# EAGLE schematic filterboard (EAGLE 6.5.0)
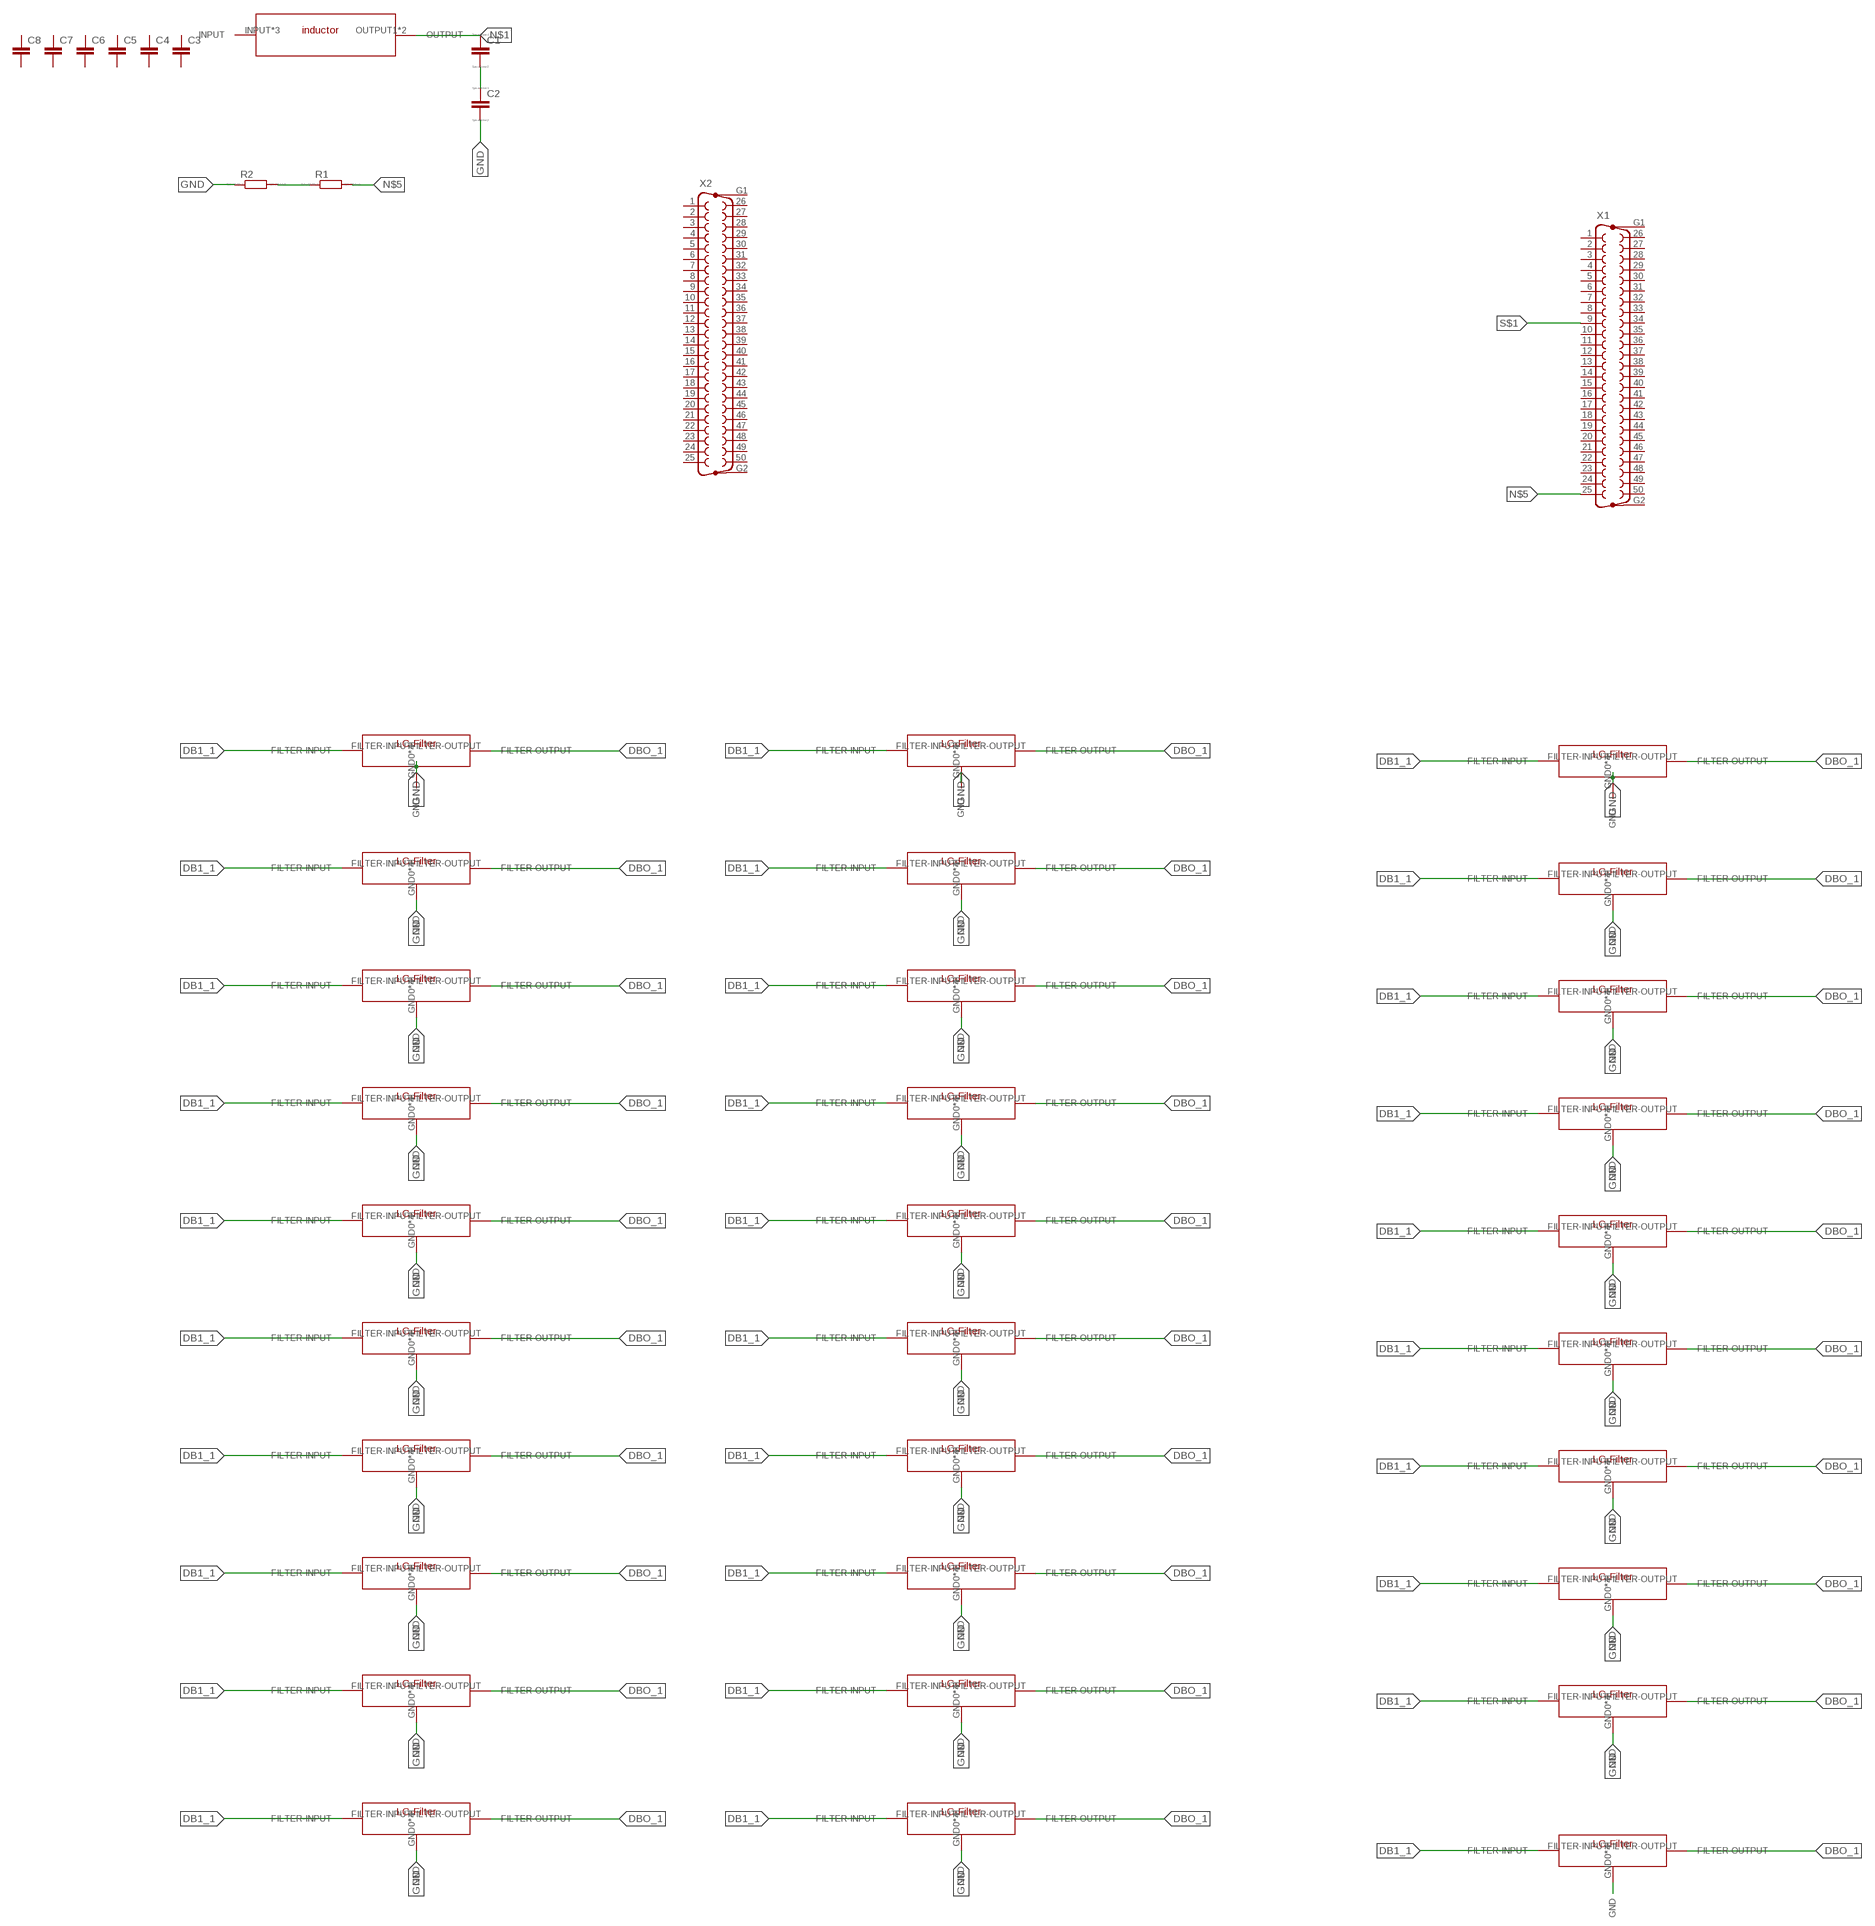
[diagram p0: schematic, sheet 1, part 1 of 2]
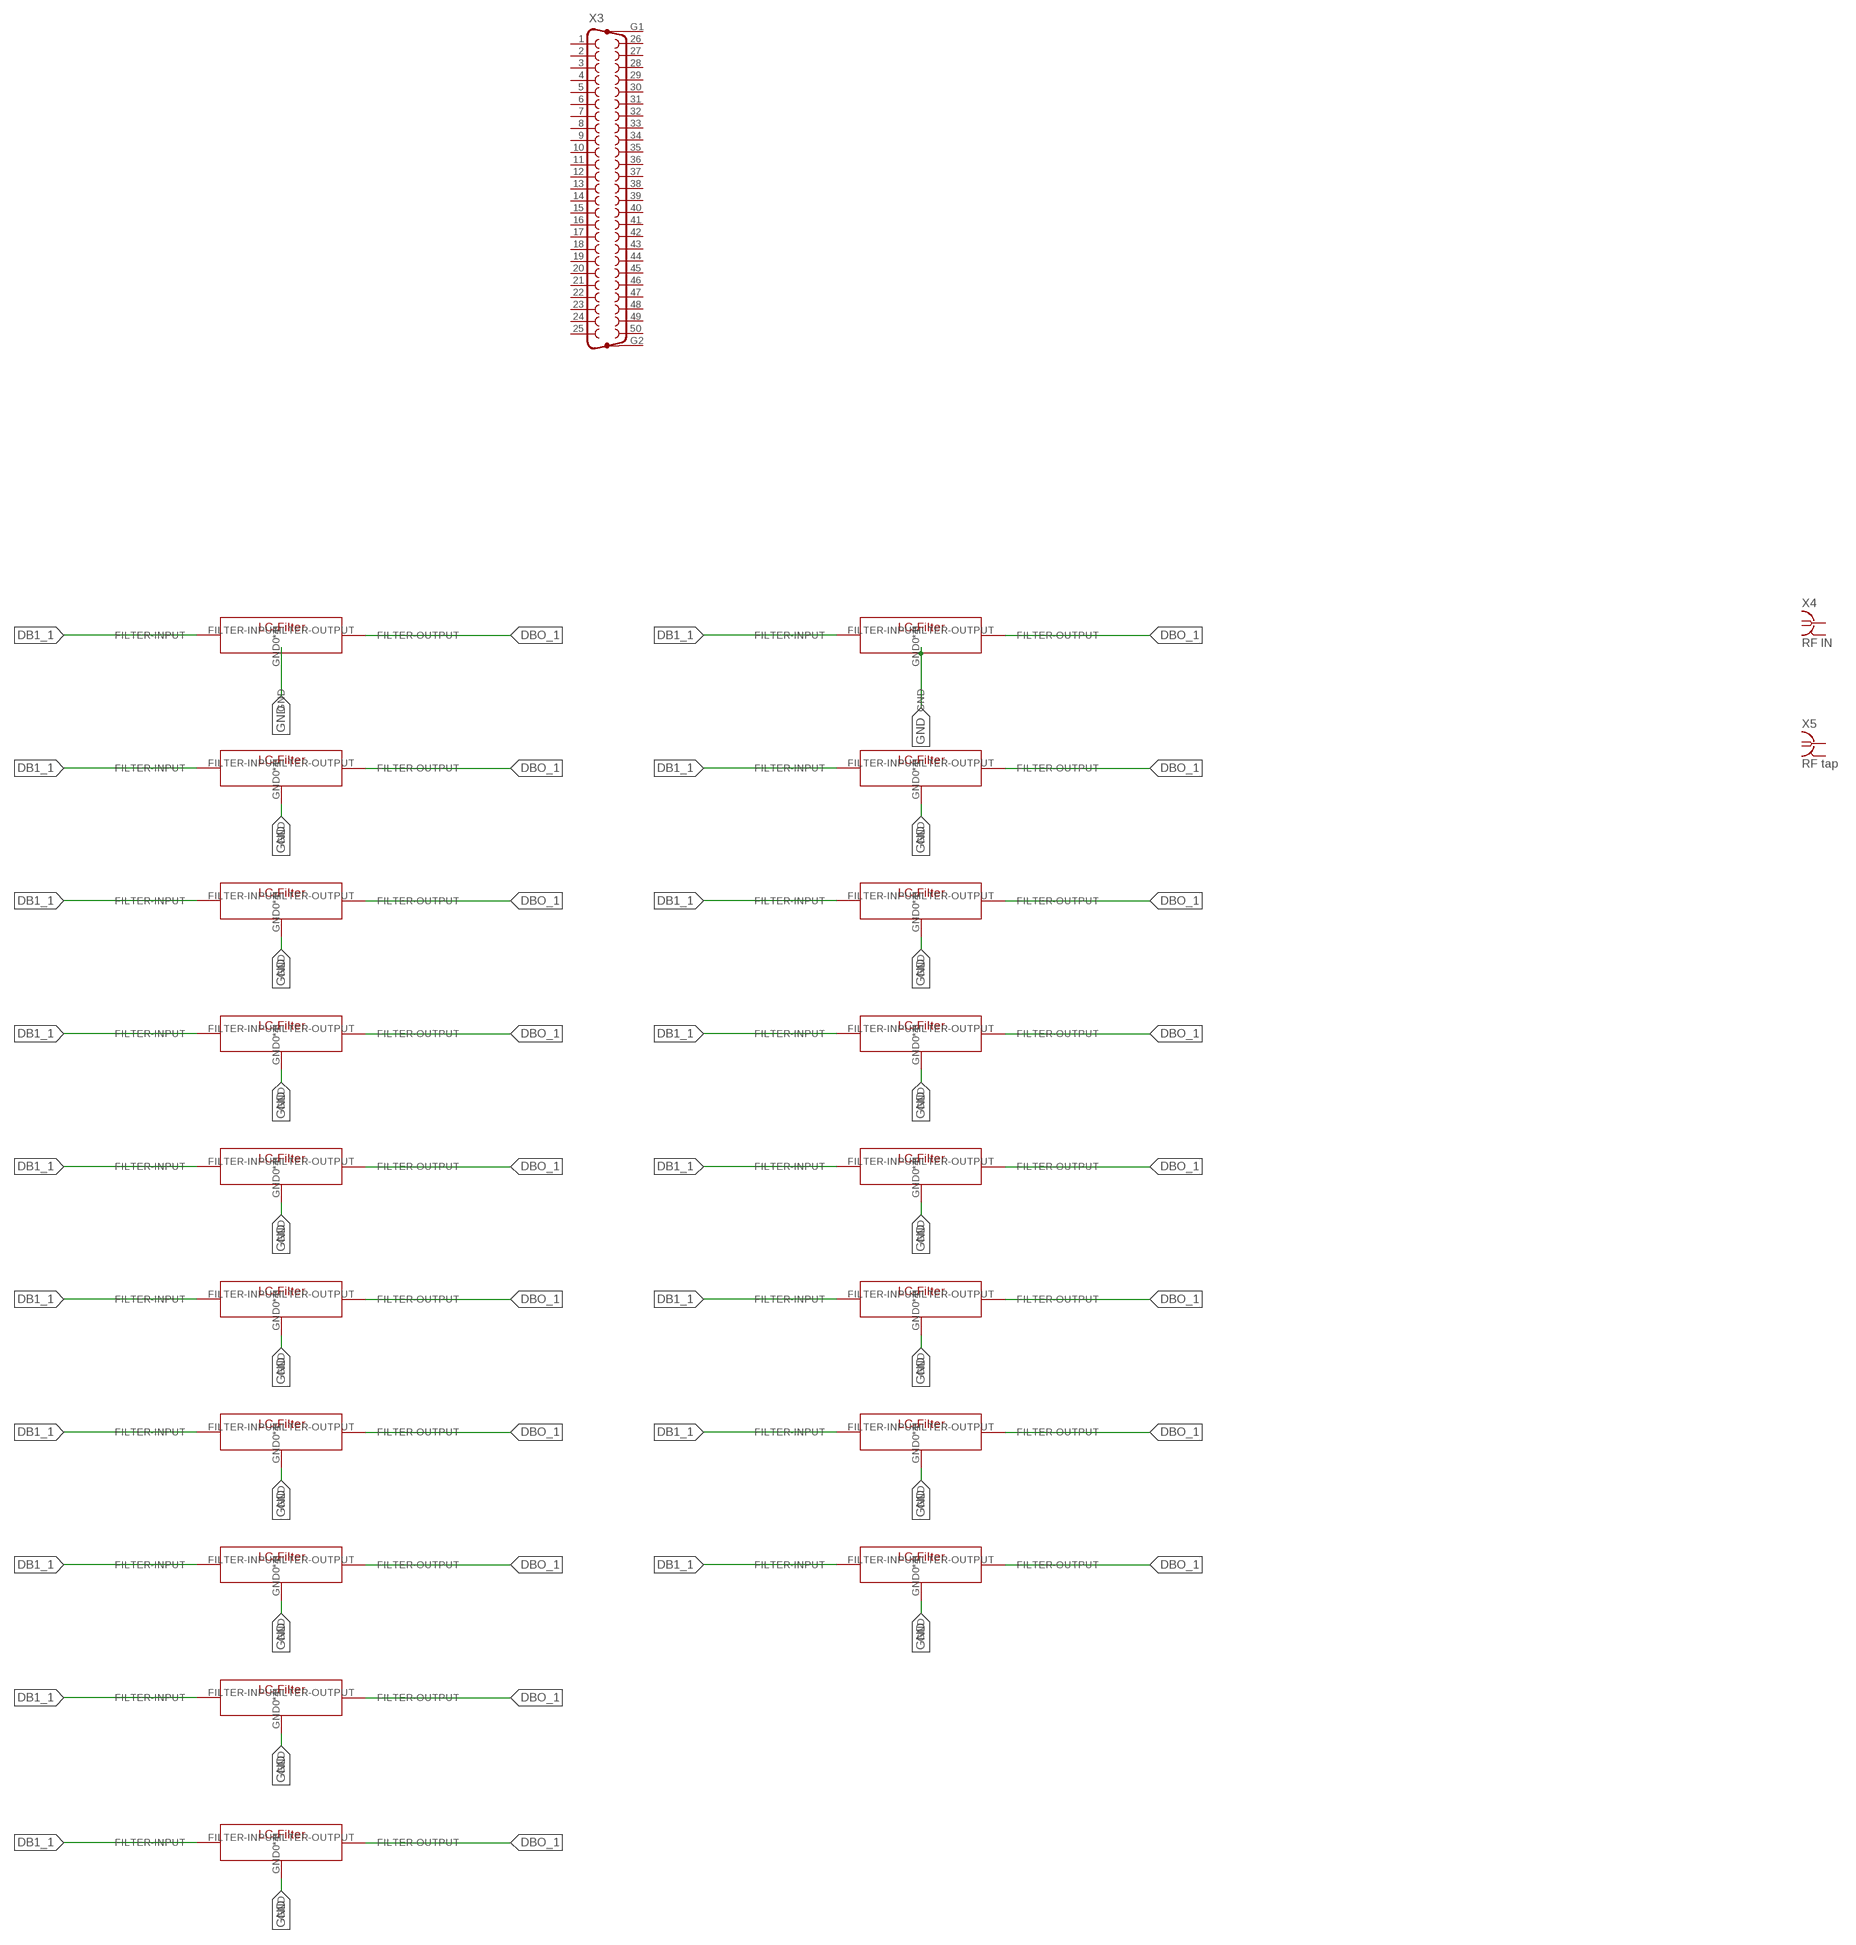
[diagram p1: schematic, sheet 1, part 2 of 2]

## Parts
C1  C  [C0805]
C2  C  [C0805]
C3  C5/4.5  [C5B4.5]
C4  C5/4.5  [C5B4.5]
C5  C5/4.5  [C5B4.5]
C6  C5/4.5  [C5B4.5]
C7  C5/4.5  [C5B4.5]
C8  C5/4.5  [C5B4.5]
R1  RR0603  [R0603]
R2  RR0603  [R0603]
U$1  COILCRAFT-LC7POLE  [COILCRAFT-LC7POLE]
U$2  COILCRAFT-LC7POLE  [COILCRAFT-LC7POLE]
U$3  COILCRAFT-LC7POLE  [COILCRAFT-LC7POLE]
U$4  COILCRAFT-LC7POLE  [COILCRAFT-LC7POLE]
U$5  COILCRAFT-LC7POLE  [COILCRAFT-LC7POLE]
U$6  COILCRAFT-LC7POLE  [COILCRAFT-LC7POLE]
U$7  COILCRAFT-LC7POLE  [COILCRAFT-LC7POLE]
U$8  COILCRAFT-LC7POLE  [COILCRAFT-LC7POLE]
U$9  COILCRAFT-LC7POLE  [COILCRAFT-LC7POLE]
U$10  COILCRAFT-LC7POLE  [COILCRAFT-LC7POLE]
U$11  COILCRAFT-LC7POLE  [COILCRAFT-LC7POLE]
U$12  COILCRAFT-LC7POLE  [COILCRAFT-LC7POLE]
U$13  COILCRAFT-LC7POLE  [COILCRAFT-LC7POLE]
U$14  COILCRAFT-LC7POLE  [COILCRAFT-LC7POLE]
U$15  COILCRAFT-LC7POLE  [COILCRAFT-LC7POLE]
U$16  COILCRAFT-LC7POLE  [COILCRAFT-LC7POLE]
U$17  COILCRAFT-LC7POLE  [COILCRAFT-LC7POLE]
U$18  COILCRAFT-LC7POLE  [COILCRAFT-LC7POLE]
U$19  COILCRAFT-LC7POLE  [COILCRAFT-LC7POLE]
U$20  COILCRAFT-LC7POLE  [COILCRAFT-LC7POLE]
U$21  COILCRAFT-LC7POLE  [COILCRAFT-LC7POLE]
U$22  COILCRAFT-LC7POLE  [COILCRAFT-LC7POLE]
U$23  COILCRAFT-LC7POLE  [COILCRAFT-LC7POLE]
U$24  COILCRAFT-LC7POLE  [COILCRAFT-LC7POLE]
U$25  COILCRAFT-LC7POLE  [COILCRAFT-LC7POLE]
U$26  COILCRAFT-LC7POLE  [COILCRAFT-LC7POLE]
U$27  COILCRAFT-LC7POLE  [COILCRAFT-LC7POLE]
U$28  COILCRAFT-LC7POLE  [COILCRAFT-LC7POLE]
U$29  COILCRAFT-LC7POLE  [COILCRAFT-LC7POLE]
U$30  COILCRAFT-LC7POLE  [COILCRAFT-LC7POLE]
U$31  COILCRAFT-LC7POLE  [COILCRAFT-LC7POLE]
U$32  COILCRAFT-LC7POLE  [COILCRAFT-LC7POLE]
U$33  COILCRAFT-LC7POLE  [COILCRAFT-LC7POLE]
U$34  COILCRAFT-LC7POLE  [COILCRAFT-LC7POLE]
U$35  COILCRAFT-LC7POLE  [COILCRAFT-LC7POLE]
U$36  COILCRAFT-LC7POLE  [COILCRAFT-LC7POLE]
U$37  COILCRAFT-LC7POLE  [COILCRAFT-LC7POLE]
U$38  COILCRAFT-LC7POLE  [COILCRAFT-LC7POLE]
U$39  COILCRAFT-LC7POLE  [COILCRAFT-LC7POLE]
U$40  COILCRAFT-LC7POLE  [COILCRAFT-LC7POLE]
U$41  COILCRAFT-LC7POLE  [COILCRAFT-LC7POLE]
U$42  COILCRAFT-LC7POLE  [COILCRAFT-LC7POLE]
U$43  COILCRAFT-LC7POLE  [COILCRAFT-LC7POLE]
U$44  COILCRAFT-LC7POLE  [COILCRAFT-LC7POLE]
U$45  COILCRAFT-LC7POLE  [COILCRAFT-LC7POLE]
U$46  COILCRAFT-LC7POLE  [COILCRAFT-LC7POLE]
U$47  COILCRAFT-LC7POLE  [COILCRAFT-LC7POLE]
U$48  COILCRAFT-LC7POLE  [COILCRAFT-LC7POLE]
U$49  XINDUCTOR  [XINDUCTOR]
X1  F50HP  [F50HP]
X2  F50HP  [F50HP]
X3  F50HP  [F50HP]
X4  RF IN  SMA-142-0711-821/826  [J502-ND-142-0711-821/826]
X5  RF tap  SMA-142-0711-821/826  [J502-ND-142-0711-821/826]

## Nets
GND: C2.2 R2.1 U$9.GND0(GND) U$9.GND1(GND) U$9.GND2(GND) U$9.GND3(GND) U$36.GND0(GND) U$36.GND1(GND) U$36.GND2(GND) U$36.GND3(GND) U$45.GND0(GND) U$45.GND1(GND) U$45.GND2(GND) U$45.GND3(GND)
N$1: C1.1
N$2: C1.2 C2.1
N$3: R1.1 R2.2
N$5: R1.2 X1.25
S$1: X1.9
Unconnected: C3.1 C3.2 C4.1 C4.2 C5.1 C5.2 C6.1 C6.2 C7.1 C7.2 C8.1 C8.2 U$1.FILTER-INPUT U$1.FILTER-OUTPUT U$1.GND0(GND) U$1.GND1(GND) U$1.GND2(GND) U$1.GND3(GND) U$2.FILTER-INPUT U$2.FILTER-OUTPUT U$2.GND0(GND) U$2.GND1(GND) U$2.GND2(GND) U$2.GND3(GND) U$3.FILTER-INPUT U$3.FILTER-OUTPUT U$3.GND0(GND) U$3.GND1(GND) U$3.GND2(GND) U$3.GND3(GND) U$4.FILTER-INPUT U$4.FILTER-OUTPUT U$4.GND0(GND) U$4.GND1(GND) U$4.GND2(GND) U$4.GND3(GND) U$5.FILTER-INPUT U$5.FILTER-OUTPUT U$5.GND0(GND) U$5.GND1(GND) U$5.GND2(GND) U$5.GND3(GND) U$6.FILTER-INPUT U$6.FILTER-OUTPUT U$6.GND0(GND) U$6.GND1(GND) U$6.GND2(GND) U$6.GND3(GND) U$7.FILTER-INPUT U$7.FILTER-OUTPUT U$7.GND0(GND) U$7.GND1(GND) U$7.GND2(GND) U$7.GND3(GND) U$8.FILTER-INPUT U$8.FILTER-OUTPUT U$8.GND0(GND) U$8.GND1(GND) U$8.GND2(GND) U$8.GND3(GND) U$9.FILTER-INPUT U$9.FILTER-OUTPUT U$10.FILTER-INPUT U$10.FILTER-OUTPUT U$10.GND0(GND) U$10.GND1(GND) U$10.GND2(GND) U$10.GND3(GND) U$11.FILTER-INPUT U$11.FILTER-OUTPUT U$11.GND0(GND) U$11.GND1(GND) U$11.GND2(GND) U$11.GND3(GND) U$12.FILTER-INPUT U$12.FILTER-OUTPUT U$12.GND0(GND) U$12.GND1(GND) U$12.GND2(GND) U$12.GND3(GND) U$13.FILTER-INPUT U$13.FILTER-OUTPUT U$13.GND0(GND) U$13.GND1(GND) U$13.GND2(GND) U$13.GND3(GND) U$14.FILTER-INPUT U$14.FILTER-OUTPUT U$14.GND0(GND) U$14.GND1(GND) U$14.GND2(GND) U$14.GND3(GND) U$15.FILTER-INPUT U$15.FILTER-OUTPUT U$15.GND0(GND) U$15.GND1(GND) U$15.GND2(GND) U$15.GND3(GND) U$16.FILTER-INPUT U$16.FILTER-OUTPUT U$16.GND0(GND) U$16.GND1(GND) U$16.GND2(GND) U$16.GND3(GND) U$17.FILTER-INPUT U$17.FILTER-OUTPUT U$17.GND0(GND) U$17.GND1(GND) U$17.GND2(GND) U$17.GND3(GND) U$18.FILTER-INPUT U$18.FILTER-OUTPUT U$18.GND0(GND) U$18.GND1(GND) U$18.GND2(GND) U$18.GND3(GND) U$19.FILTER-INPUT U$19.FILTER-OUTPUT U$19.GND0(GND) U$19.GND1(GND) U$19.GND2(GND) U$19.GND3(GND) U$20.FILTER-INPUT U$20.FILTER-OUTPUT U$20.GND0(GND) U$20.GND1(GND) U$20.GND2(GND) U$20.GND3(GND) U$21.FILTER-INPUT U$21.FILTER-OUTPUT U$21.GND0(GND) U$21.GND1(GND) U$21.GND2(GND) U$21.GND3(GND) U$22.FILTER-INPUT U$22.FILTER-OUTPUT U$22.GND0(GND) U$22.GND1(GND) U$22.GND2(GND) U$22.GND3(GND) U$23.FILTER-INPUT U$23.FILTER-OUTPUT U$23.GND0(GND) U$23.GND1(GND) U$23.GND2(GND) U$23.GND3(GND) U$24.FILTER-INPUT U$24.FILTER-OUTPUT U$24.GND0(GND) U$24.GND1(GND) U$24.GND2(GND) U$24.GND3(GND) U$25.FILTER-INPUT U$25.FILTER-OUTPUT U$25.GND0(GND) U$25.GND1(GND) U$25.GND2(GND) U$25.GND3(GND) U$26.FILTER-INPUT U$26.FILTER-OUTPUT U$26.GND0(GND) U$26.GND1(GND) U$26.GND2(GND) U$26.GND3(GND) U$27.FILTER-INPUT U$27.FILTER-OUTPUT U$27.GND0(GND) U$27.GND1(GND) U$27.GND2(GND) U$27.GND3(GND) U$28.FILTER-INPUT U$28.FILTER-OUTPUT U$28.GND0(GND) U$28.GND1(GND) U$28.GND2(GND) U$28.GND3(GND) U$29.FILTER-INPUT U$29.FILTER-OUTPUT U$29.GND0(GND) U$29.GND1(GND) U$29.GND2(GND) U$29.GND3(GND) U$30.FILTER-INPUT U$30.FILTER-OUTPUT U$30.GND0(GND) U$30.GND1(GND) U$30.GND2(GND) U$30.GND3(GND) U$31.FILTER-INPUT U$31.FILTER-OUTPUT U$31.GND0(GND) U$31.GND1(GND) U$31.GND2(GND) U$31.GND3(GND) U$32.FILTER-INPUT U$32.FILTER-OUTPUT U$32.GND0(GND) U$32.GND1(GND) U$32.GND2(GND) U$32.GND3(GND) U$33.FILTER-INPUT U$33.FILTER-OUTPUT U$33.GND0(GND) U$33.GND1(GND) U$33.GND2(GND) U$33.GND3(GND) U$34.FILTER-INPUT U$34.FILTER-OUTPUT U$34.GND0(GND) U$34.GND1(GND) U$34.GND2(GND) U$34.GND3(GND) U$35.FILTER-INPUT U$35.FILTER-OUTPUT U$35.GND0(GND) U$35.GND1(GND) U$35.GND2(GND) U$35.GND3(GND) U$36.FILTER-INPUT U$36.FILTER-OUTPUT U$37.FILTER-INPUT U$37.FILTER-OUTPUT U$37.GND0(GND) U$37.GND1(GND) U$37.GND2(GND) U$37.GND3(GND) U$38.FILTER-INPUT U$38.FILTER-OUTPUT U$38.GND0(GND) U$38.GND1(GND) U$38.GND2(GND) U$38.GND3(GND) U$39.FILTER-INPUT U$39.FILTER-OUTPUT U$39.GND0(GND) U$39.GND1(GND) U$39.GND2(GND) U$39.GND3(GND) U$40.FILTER-INPUT U$40.FILTER-OUTPUT U$40.GND0(GND) U$40.GND1(GND) U$40.GND2(GND) U$40.GND3(GND) U$41.FILTER-INPUT U$41.FILTER-OUTPUT U$41.GND0(GND) U$41.GND1(GND) U$41.GND2(GND) U$41.GND3(GND) U$42.FILTER-INPUT U$42.FILTER-OUTPUT U$42.GND0(GND) U$42.GND1(GND) U$42.GND2(GND) U$42.GND3(GND) U$43.FILTER-INPUT U$43.FILTER-OUTPUT U$43.GND0(GND) U$43.GND1(GND) U$43.GND2(GND) U$43.GND3(GND) U$44.FILTER-INPUT U$44.FILTER-OUTPUT U$44.GND0(GND) U$44.GND1(GND) U$44.GND2(GND) U$44.GND3(GND) U$45.FILTER-INPUT U$45.FILTER-OUTPUT U$46.FILTER-INPUT U$46.FILTER-OUTPUT U$46.GND0(GND) U$46.GND1(GND) U$46.GND2(GND) U$46.GND3(GND) U$47.FILTER-INPUT U$47.FILTER-OUTPUT U$47.GND0(GND) U$47.GND1(GND) U$47.GND2(GND) U$47.GND3(GND) U$48.FILTER-INPUT U$48.FILTER-OUTPUT U$48.GND0(GND) U$48.GND1(GND) U$48.GND2(GND) U$48.GND3(GND) U$49.INPUT U$49.INPUT2(INPUT) U$49.INPUT3(INPUT) U$49.OUTPUT1(OUTPUT) U$49.OUTPUT2(OUTPUT) X1.1 X1.2 X1.3 X1.4 X1.5 X1.6 X1.7 X1.8 X1.10 X1.11 X1.12 X1.13 X1.14 X1.15 X1.16 X1.17 X1.18 X1.19 X1.20 X1.21 X1.22 X1.23 X1.24 X1.26 X1.27 X1.28 X1.29 X1.30 X1.31 X1.32 X1.33 X1.34 X1.35 X1.36 X1.37 X1.38 X1.39 X1.40 X1.41 X1.42 X1.43 X1.44 X1.45 X1.46 X1.47 X1.48 X1.49 X1.50 X1.G1 X1.G2 X2.1 X2.2 X2.3 X2.4 X2.5 X2.6 X2.7 X2.8 X2.9 X2.10 X2.11 X2.12 X2.13 X2.14 X2.15 X2.16 X2.17 X2.18 X2.19 X2.20 X2.21 X2.22 X2.23 X2.24 X2.25 X2.26 X2.27 X2.28 X2.29 X2.30 X2.31 X2.32 X2.33 X2.34 X2.35 X2.36 X2.37 X2.38 X2.39 X2.40 X2.41 X2.42 X2.43 X2.44 X2.45 X2.46 X2.47 X2.48 X2.49 X2.50 X2.G1 X2.G2 X3.1 X3.2 X3.3 X3.4 X3.5 X3.6 X3.7 X3.8 X3.9 X3.10 X3.11 X3.12 X3.13 X3.14 X3.15 X3.16 X3.17 X3.18 X3.19 X3.20 X3.21 X3.22 X3.23 X3.24 X3.25 X3.26 X3.27 X3.28 X3.29 X3.30 X3.31 X3.32 X3.33 X3.34 X3.35 X3.36 X3.37 X3.38 X3.39 X3.40 X3.41 X3.42 X3.43 X3.44 X3.45 X3.46 X3.47 X3.48 X3.49 X3.50 X3.G1 X3.G2 X4.1 X4.G@1 X4.G@2 X4.G@3 X4.G@4 X5.1 X5.G@1 X5.G@2 X5.G@3 X5.G@4

## Library data of the parts
C1 C2 = eagle-ltspice:C: CAPACITOR, European symbol; SPICEMODEL: NONE; SPICEPREFIX: C
C3-C8 = capacitor-wima:C: CAPACITOR naming: grid - package width
R1 R2 = eagle-ltspice:R: RESISTOR, European symbol; SPICEMODEL: NONE; SPICEPREFIX: R
U$1-U$48 = Eagle-LC7Filter:COILCRAFT-LC7POLE
U$49 = MichaelsLibrary:XINDUCTOR
X1-X3 = con-subd:F50HP: SUB-D; OC_FARNELL: unknown; OC_NEWARK: unknown
X4 X5 = con-coax:SMA-: SMA 50 Ohm End Launch Jack Receptacle - Round Contact Johnson Components Source: www.johnsoncomponents.com .. J502-ND.pdf; MF: JOHNSON COMPONENTS; MPN: 142-0711-821; OC_FARNELL: 1019328; OC_NEWARK: 16F3627